# EasyEDA Pro project AQM2bv2.epro

# Schematic Schematic1
Board Name: Board1; Create Date: 2026-05-04; Page Name: P1; Project Name: AQM2; Schematic Name: Schematic1; Update Date: 2026-05-03; Company: EasyEDA.com; Page Size: A4; Version: V1.0
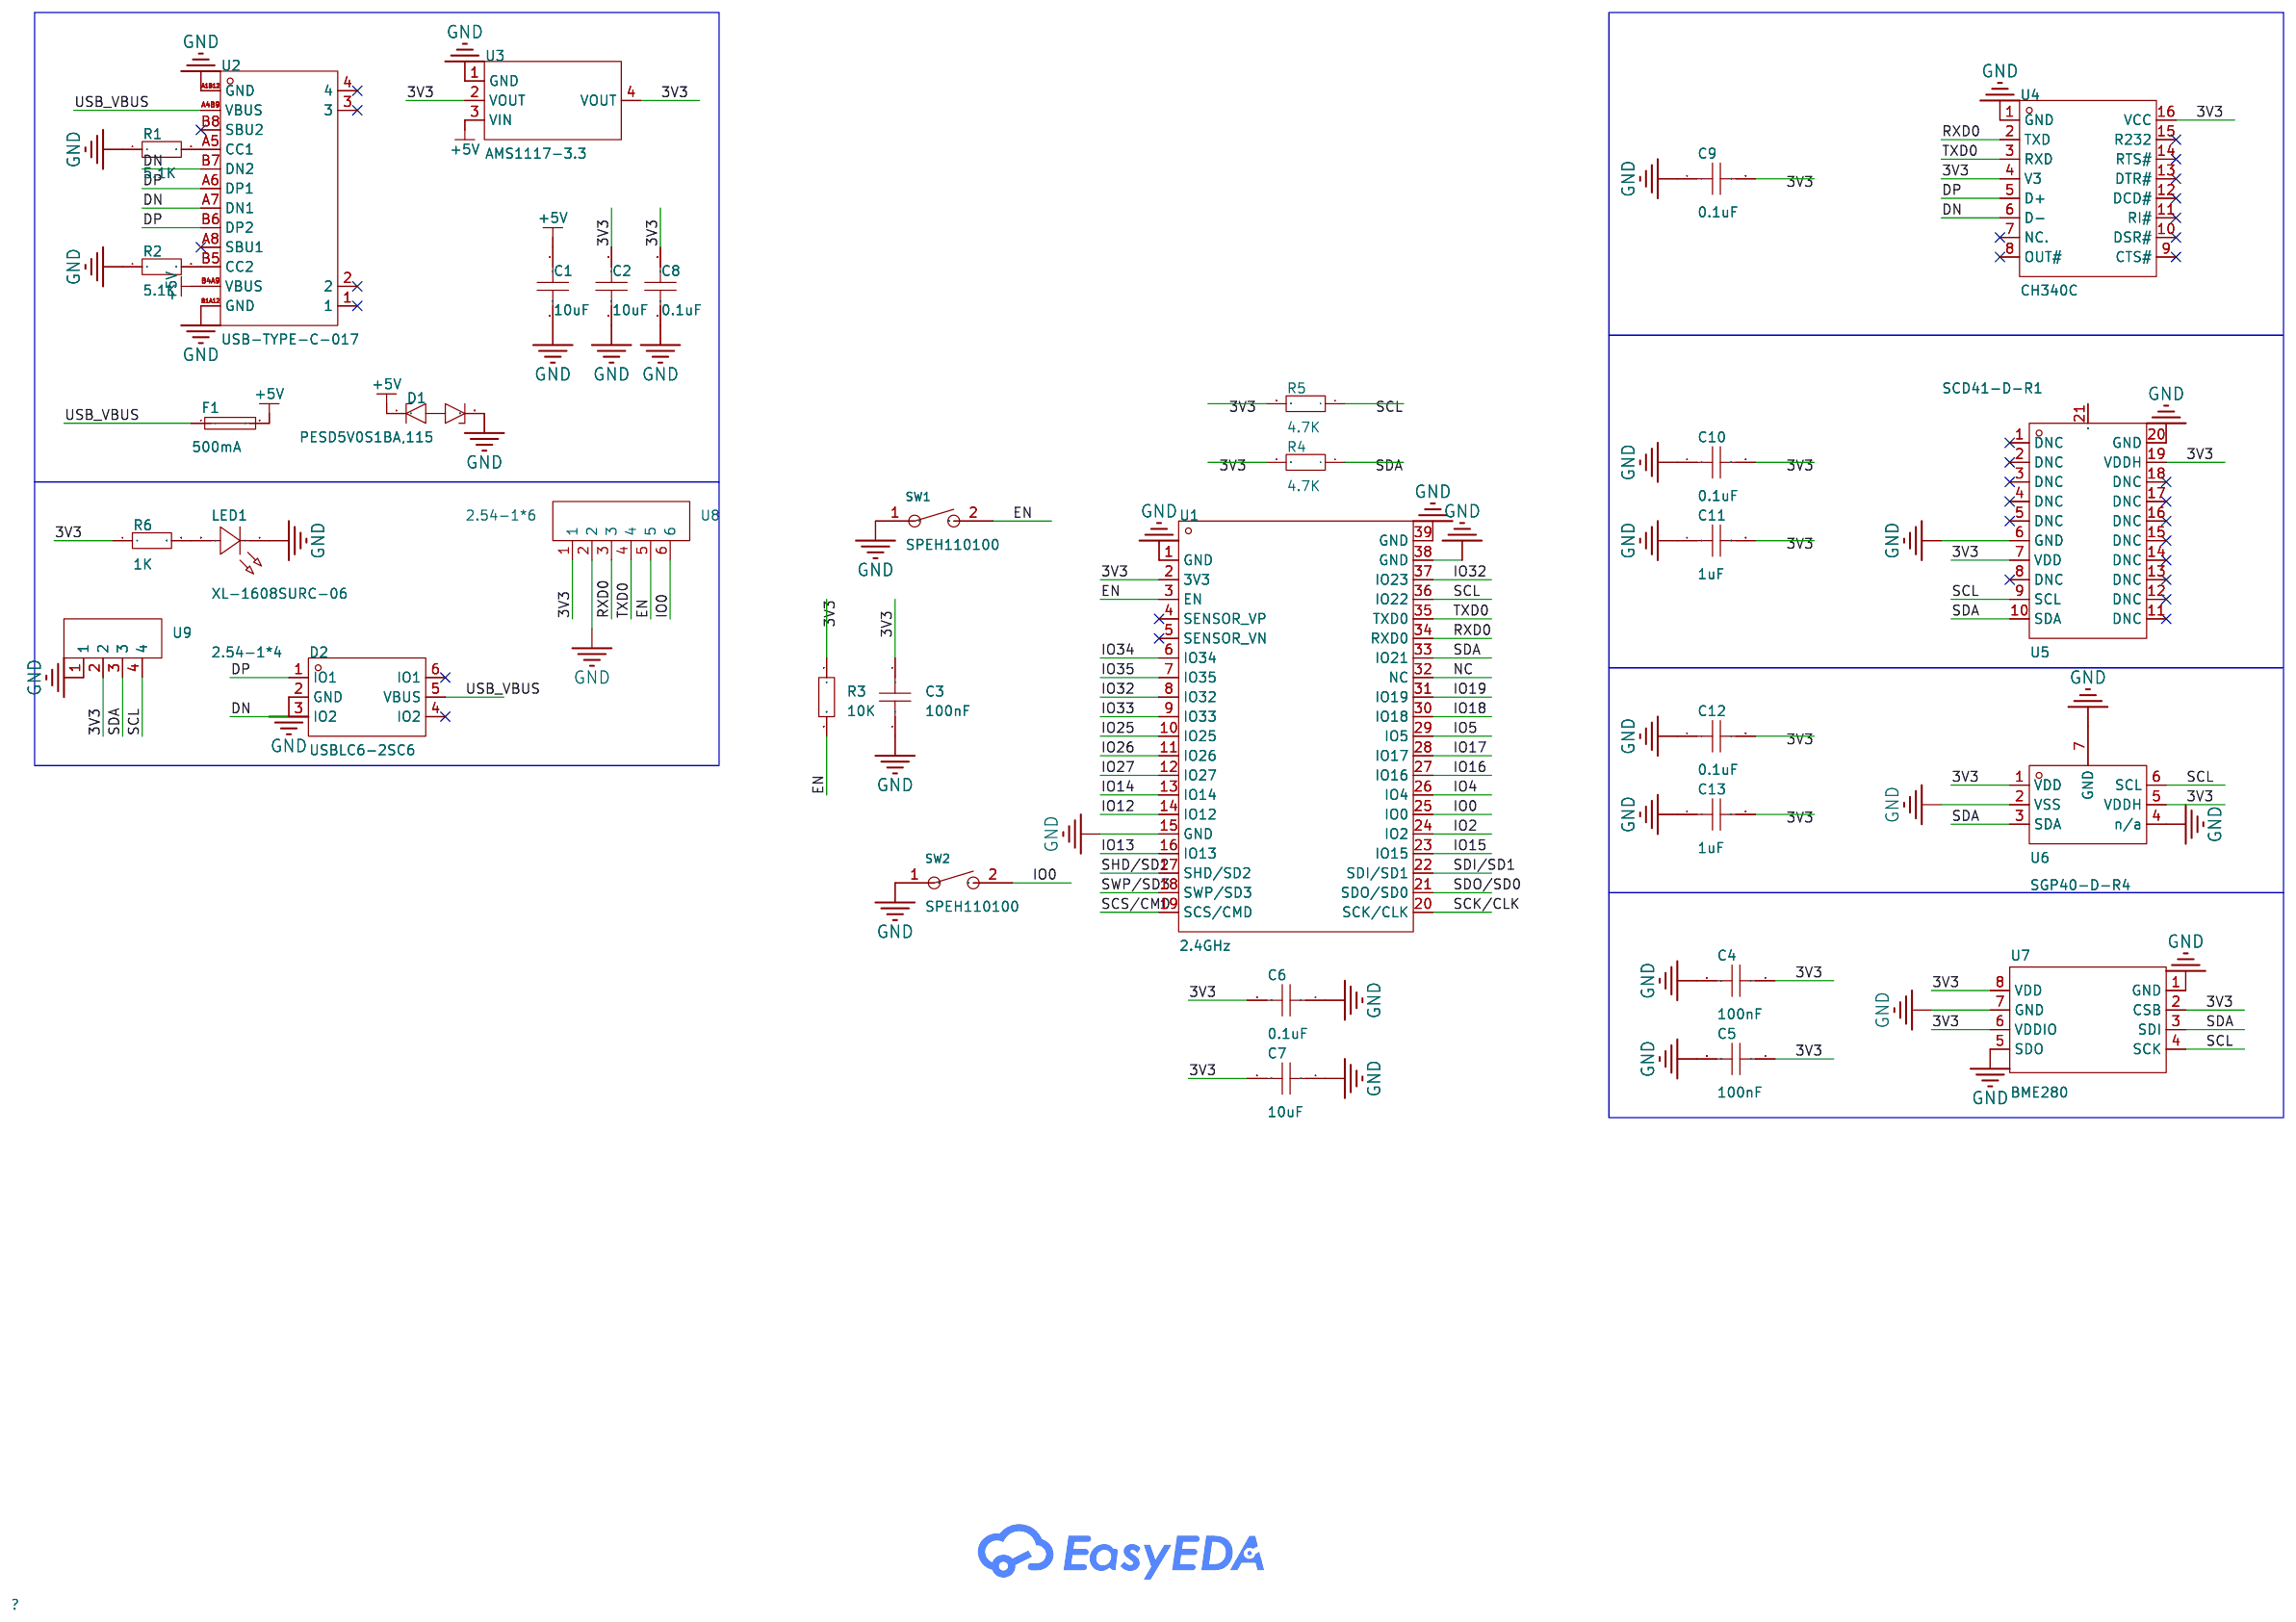
[diagram p0: schematic sheet]

## Parts
C1  10uF  [C0603]
C2  10uF  [C0603]
C3  100nF  [C0603]
C4  100nF  [C0603]
C5  100nF  [C0603]
C6  0.1uF  [C0603]
C7  10uF  [C0603]
C8  0.1uF  [C0603]
C9  0.1uF  [C0603]
C10  0.1uF  [C0603]
C11  1uF  [C0603]
C12  0.1uF  [C0603]
C13  1uF  [C0603]
D1  PESD5V0S1BA,115  [SOD-323_L1.7-W1.3-LS2.5-BI]
D2  USBLC6-2SC6  [SOT-23-6_L2.9-W1.6-P0.95-LS2.8-BL]
F1  500mA  [F1812]
LED1  XL-1608SURC-06  [LED0603-RD_RED]
R1  5.1K  [R0603]
R2  5.1K  [R0603]
R3  10K  [R0603]
R4  4.7K  [R0603]
R5  4.7K  [R0603]
R6  1K  [R0603]
SW1  SPEH110100  [SW-SMD_L6.0-W6.0-LS6.6]
SW2  SPEH110100  [SW-SMD_L6.0-W6.0-LS6.6]
U1  2.4GHz  [WIFIM-SMD_ESP32-WROOM-32-N4]
U2  USB-TYPE-C-017  [USB-TYPE-C-SMD_C9900008089]
U3  AMS1117-3.3  [SOT-223-3_L6.5-W3.4-P2.30-LS7.0-BR]
U4  CH340C  [SOP-16_L10.0-W3.9-P1.27-LS6.0-BL]
U5  SCD41-D-R1  [SENSOR-SMD_SCD41-D-R1]
U6  SGP40-D-R4  [DFN-6_L2.4-W2.4-P0.80-TL-EP]
U7  BME280  [LGA-8_BME280_BL]
U8  2.54-1*6  [HDR-TH_6P-P2.54-V-M]
U9  2.54-1*4  [HDR-TH_4P-P2.54-V-M-1]

## Library data of the parts
C1-C13 = CAP_0603: Supplier Footprint: 0603
D1 = PESD5V0S1BA,115: Polarity:Bidirectional Reverse Stand-Off Voltage (Vrwm):5V Clamping Voltage:14V Peak Pulse Current (Ipp):12A@8/20us Peak Pulse Power Dissipation (Ppp):130W@8/20us Voltage - Breakdown:9.5V Reverse Leakage Current (Ir):5nA Number of Channels:1 Operating Tem; LCSC Part Name: 双向ESD 5V截止 峰值浪涌电流：12A@8/20us; Supplier Part: C19224; Manufacturer: Nexperia(安世); Supplier Footprint: SOD-323; JLCPCB Part Class: Extended Part; Datasheet: https://item.szlcsc.com/datasheet/PESD5V0S1BA%252C115/19931.html; Supplier: LCSC; Polarity: Bidirectional; Reverse Stand-Off Voltage (Vrwm): 5V; Clamping Voltage: 14V; Peak Pulse Current (Ipp): 12A@8/20us; Peak Pulse Power Dissipation (Ppp): 130W@8/20us; Voltage - Breakdown: 9.5V; Reverse Leakage Current (Ir): 5nA; Number of Channels: 1; Operating Temperature: -55℃~+150℃; level of protection: IEC 61000-4-5；IEC 61000-4-2; Type: ESD; Junction Capacitance: 35pF
D2 = USBLC6-2SC6_C2827654: Polarity:Unidirectional Reverse Stand-Off Voltage (Vrwm):5V Clamping Voltage:12V Peak Pulse Current (Ipp):6A Peak Pulse Power Dissipation (Ppp):150W Voltage - Breakdown:6V Reverse Leakage Current (Ir):80nA Number of Channels:2 Operating Temperature:-55℃~+; LCSC Part Name: ESD，可防30kV静电; Supplier Part: C2827654; Manufacturer: TECH PUBLIC(台舟); Supplier Footprint: SOT-23-6; JLCPCB Part Class: Extended Part; Datasheet: https://item.szlcsc.com/datasheet/USBLC6-2SC6/2973336.html; Supplier: LCSC; Polarity: Unidirectional; Reverse Stand-Off Voltage (Vrwm): 5V; Clamping Voltage: 12V; Peak Pulse Current (Ipp): 6A; Peak Pulse Power Dissipation (Ppp): 150W; Voltage - Breakdown: 6V; Reverse Leakage Current (Ir): 80nA; Number of Channels: 2; Operating Temperature: -55℃~+125℃; level of protection: IEC 61000-4-2；IEC 61000-4-4；IEC 61000-4-5; Type: ESD; Junction Capacitance: 0.35pF
F1 = SMD1812P260TF/16_C438899: Voltage - Max:16V Current - Max:100A Hold Current:2.6A Trip Current:5A Power Dissipation:1.2W Resistance - Initial (Ri) (Min):15mΩ Resistance - Post Trip (R1) (Max):50mΩ Time to Trip(Max):5s Operating Temperature:-40℃~+85℃ Operating Temperature:-40℃~+85℃; LCSC Part Name: 16V 2.6A 1812自恢复; Supplier Part: C438899; Manufacturer: PTTC(聚鼎); Supplier Footprint: 1812; JLCPCB Part Class: Extended Part; Datasheet: https://item.szlcsc.com/datasheet/SMD1812P260TF%252F16/437537.html; Supplier: LCSC; Voltage - Max: 16V; Current - Max: 100A; Hold Current: 2.6A; Trip Current: 5A; Power Dissipation: 1.2W; Resistance - Initial (Ri) (Min): 15mΩ; Resistance - Post Trip (R1) (Max): 50mΩ; Time to Trip(Max): 5s; Operating Temperature: -40℃~+85℃; Length: 4.9mm; Width: 3.5mm; Height: 2mm
LED1 = XL-1608SURC-06: Lamp Holder Type:- Illumination Color:Red Voltage - Forward(Vf):2.3V Voltage - Forward(Vf):2.3V Power(Watts):50mW Forward Current:20mA Wavelength - Dominant:620nm~630nm Wavelength - Dominant:620nm~630nm Peak Wavelength:625nm Diode Configuration:Discrete D; LCSC Part Name: 0603红色贴片式发光二极管; Supplier Part: C965799; Manufacturer: XINGLIGHT(成兴光); Supplier Footprint: 0603; JLCPCB Part Class: Extended Part; Datasheet: https://item.szlcsc.com/datasheet/XL-1608SURC-06/1051408.html; Supplier: LCSC; Illumination Color: Red; Voltage - Forward(Vf): 2.3V; Power(Watts): 50mW; Forward Current: 20mA; Wavelength - Dominant: 620nm~630nm; Peak Wavelength: 625nm; Diode Configuration: Discrete Diode; Lens Color: Water Clear; Luminous Intensity: 225mcd; Viewing Angle: 120°; Mounting Style: Top-mount; Operating Temperature: -40℃~+85℃
R1-R6 = Res_0603: Supplier Footprint: 0603
SW1 SW2 = SPEH110100: Self Lock / No Lock:- Actuator Style:Square Button IP Rating:- Mounting Type:Surface Mount,Vertical Contact Current:50mA Voltage Rating:16V Actuator/Cap Color:Black With Lamp:- Termination Style:J-Lead Operating Force:1.96N Operating Temperature:-40℃~+90℃; Supplier Part: C97448; Manufacturer: ALPSALPINE(阿尔卑斯阿尔派); Supplier Footprint: SMD,6x6mm; JLCPCB Part Class: Extended Part; Datasheet: https://item.szlcsc.com/datasheet/SPEH110100/98656.html; Supplier: LCSC; Actuator Style: Square Button; Mounting Type: Surface Mount,Vertical; Contact Current: 50mA; Voltage Rating: 16V; Actuator/Cap Color: Black; Termination Style: J-Lead; Operating Force: 1.96N; Operating Temperature: -40℃~+90℃
U1 = ESP32-WROOM-32-N4: Utilized IC / Part:ESP32-DOWDQ6 Wireless Standard:Bluetooth4.2 Interface Type:I2C；GPIO；UART；DAC；SPI；PWM；SDIO；ADC Frequency:2.4GHz Output Power:20dBm Output Power:20dBm Voltage - Supply:2.7V~3.6V Voltage - Supply:2.7V~3.6V Sensitivity:-98dBm Sensitivity:-9; LCSC Part Name: 不带固件 WiFi+蓝牙4.2+双核CPU模块; Supplier Part: C82899; Manufacturer: ESPRESSIF(乐鑫); Supplier Footprint: SMD,25.5x18mm; JLCPCB Part Class: Extended Part; Datasheet: https://item.szlcsc.com/datasheet/ESP32-WROOM-32-N4/84060.html; Supplier: LCSC; Utilized IC / Part: ESP32-DOWDQ6; Wireless Standard: Bluetooth4.2; Interface Type: I2C；GPIO；UART；DAC；SPI；PWM；SDIO；ADC; Output Power: 20dBm; Voltage - Supply: 2.7V~3.6V; Sensitivity: -98dBm; Operating Temperature: -40℃~+85℃
U2 = USB-TYPE-C-017: Connector Type:Type-C Protocol Standard:- Gender:Female Mounting Type:Surface Mount, Right Angle Number of Contacts:16P Number of Ports:1 Current Rating-Power:3A Voltage Rating:5V Connect-Disconnect Life:10,000 cycles Length:7.35mm Operating Temperature:-; LCSC Part Name: Type-C 母 卧贴; Supplier Part: C2927037; Manufacturer: DEALON(德艺隆); Supplier Footprint: SMD; JLCPCB Part Class: Extended Part; Datasheet: https://item.szlcsc.com/datasheet/USB-TYPE-C-017/3252506.html; Supplier: LCSC; Connector Type: Type-C; Gender: Female; Mounting Type: Surface Mount, Right Angle; Number of Contacts: 16P; Number of Ports: 1; Current Rating-Power: 3A; Voltage Rating: 5V; Connect-Disconnect Life: 10,000 cycles; Length: 7.35mm; Operating Temperature: -25℃~+85℃
U3 = AMS1117-3.3_C6186: Output Type:Fixed Voltage - Supply:15V Output Voltage:3.3V Output Voltage:3.3V Output Current:1A Power Supply Rejection Ratio (PSRR):72dB@(120Hz) Voltage Dropout:1.1V@(800mA) standby current:5mA Noise:0.003%Vout Features:Over Current Protection；Thermal Sh; LCSC Part Name: 3.3V 1A 15V; Supplier Part: C6186; Manufacturer: AMS; Supplier Footprint: SOT-223; JLCPCB Part Class: Basic Part; Datasheet: https://item.szlcsc.com/datasheet/AMS1117-3.3/6652.html; Supplier: LCSC; Output Type: Fixed; Voltage - Supply: 15V; Output Voltage: 3.3V; Output Current: 1A; Power Supply Rejection Ratio (PSRR): 72dB@(120Hz); Voltage Dropout: 1.1V@(800mA); standby current: 5mA; Noise: 0.003%Vout; Features: Over Current Protection；Thermal Shutdown; Operating Temperature: -40℃~+125℃; Output Configuration: Positive; Number of Outputs: 1
U4 = CH340C: Applications Function:Transceiver USB Protocol:USB 2.0 Voltage - Supply:3.3V；5V Voltage - Supply:3.3V；5V Data Rate:2Mbps Operating Temperature:-20℃~+70℃ Operating Temperature:-20℃~+70℃ Current - Supply:7mA Supply Current (Iq):50uA; LCSC Part Name: USB转串口芯片; Supplier Part: C84681; Manufacturer: WCH(南京沁恒); Supplier Footprint: SOP-16; JLCPCB Part Class: Extended Part; Datasheet: https://item.szlcsc.com/datasheet/CH340C/85852.html; Supplier: LCSC; Applications Function: Transceiver; USB Protocol: USB 2.0; Voltage - Supply: 3.3V；5V; Data Rate: 2Mbps; Operating Temperature: -20℃~+70℃; Current - Supply: 7mA; Supply Current (Iq): 50uA
U5 = SCD41-D-R1: Type:Air quality Measurement Range:400ppm~5000ppm Measurement Range:400ppm~5000ppm Voltage - Supply:2.4V~5.5V Voltage - Supply:2.4V~5.5V Interface:I2C Tolerance:±5% Tolerance:±5% Operating Temperature:-10℃~+60℃ Operating Temperature:-10℃~+60℃ Length:10.1m; LCSC Part Name: 3.000.960 3.000.960 扩展的测量范围二氧化碳传感器 测量精度，支持单次测量（Single‑Shot）模式; Supplier Part: C3659362; Manufacturer: Sensirion(瑞士盛思锐); Supplier Footprint: LGA-20(10.1x10.1); JLCPCB Part Class: Extended Part; Datasheet: https://item.szlcsc.com/datasheet/SCD41-D-R1/4227159.html; Supplier: LCSC; Type: Air quality; Measurement Range: 400ppm~5000ppm; Voltage - Supply: 2.4V~5.5V; Interface: I2C; Tolerance: ±5%; Operating Temperature: -10℃~+60℃; Length: 10.1mm; Width: 10.1mm; Height: 6.5mm; Current - Supply: 0.36mA
U6 = SGP40-D-R4: Type:- Measurement Range:0ppm~1000ppm Measurement Range:0ppm~1000ppm Voltage - Supply:1.7V~3.6V Voltage - Supply:1.7V~3.6V Interface:I2C Operating Temperature:-10℃~+50℃ Operating Temperature:-10℃~+50℃ Length:2.44mm；2.44mm Height:0.85mm; LCSC Part Name: 3.000.384 3.000.384 适用于室内空气质量应用的 VOC 传感器; Supplier Part: C2874215; Manufacturer: Sensirion(瑞士盛思锐); Supplier Footprint: DFN-6-EP(2.4x2.4); JLCPCB Part Class: Extended Part; Datasheet: https://item.szlcsc.com/datasheet/SGP40-D-R4/3079263.html; Supplier: LCSC; Measurement Range: 0ppm~1000ppm; Voltage - Supply: 1.7V~3.6V; Interface: I2C; Operating Temperature: -10℃~+50℃; Length: 2.44mm；2.44mm; Height: 0.85mm
U7 = BME280: Temperature Range:-40℃~+85℃ Temperature Range:-40℃~+85℃ Humidity:0%RH~100%RH Humidity:0%RH~100%RH Interface:I2C；SPI Voltage - Supply:1.71V~3.6V Voltage - Supply:1.71V~3.6V Current - Supply:1.8uA Humidity Tolerance:±3%RH Humidity Tolerance:±3%RH Temperatur; LCSC Part Name: 湿度：0%RH~100%RH; Supplier Part: C92489; Manufacturer: Bosch(博世); Supplier Footprint: LGA-8(2.5x2.5); JLCPCB Part Class: Extended Part; Datasheet: https://item.szlcsc.com/datasheet/BME280/93682.html; Supplier: LCSC; Temperature Range: -40℃~+85℃; Humidity: 0%RH~100%RH; Interface: I2C；SPI; Voltage - Supply: 1.71V~3.6V; Current - Supply: 1.8uA; Humidity Tolerance: ±3%RH; Temperature Tolerance: ±0.5℃; Resolution: 16bit
U8 = 2.54-1*6: Pin Structure:1x6P Pitch:2.54mm Circluar Pins/Square Pins:Pin Header Mounting Type:Through Hole Number of Rows:1 Number of Pins:6P Current Rating:2.5A Length of Mating Pin:6mm Insulation Height:2.54mm Length of End Connection Pin:3mm Contact Material:Bras; LCSC Part Name: 1x6P 间距:2.54mm 方针 直插; Supplier Part: C5156615; Manufacturer: ZHOURI(洲日); Supplier Footprint: 插件,P=2.54mm; JLCPCB Part Class: Extended Part; Datasheet: https://item.szlcsc.com/datasheet/2.54-1*6/5790715.html; Supplier: LCSC; Pin Structure: 1x6P; Pitch: 2.54mm; Circluar Pins/Square Pins: Pin Header; Mounting Type: Through Hole; Number of Rows: 1; Number of Pins: 6P; Current Rating: 2.5A; Length of Mating Pin: 6mm; Insulation Height: 2.54mm; Length of End Connection Pin: 3mm; Contact Material: Brass; Contact Plating: Gold; Operating Temperature: -40℃~+105℃
U9 = 2.54-1*4: Pin Structure:1x4P Pitch:2.54mm Circluar Pins/Square Pins:Pin Header Mounting Type:Through Hole Number of Rows:1 Number of Pins:4P Current Rating:2.5A Length of Mating Pin:6mm Insulation Height:2.54mm Length of End Connection Pin:3mm Contact Material:Bras; LCSC Part Name: 1x4P 间距:2.54mm 方针 直插; Supplier Part: C5116483; Manufacturer: ZHOURI(洲日); Supplier Footprint: 插件,P=2.54mm; JLCPCB Part Class: Extended Part; Datasheet: https://item.szlcsc.com/datasheet/2.54-1*4/5692726.html; Supplier: LCSC; Pin Structure: 1x4P; Pitch: 2.54mm; Circluar Pins/Square Pins: Pin Header; Mounting Type: Through Hole; Number of Rows: 1; Number of Pins: 4P; Current Rating: 2.5A; Length of Mating Pin: 6mm; Insulation Height: 2.54mm; Length of End Connection Pin: 3mm; Contact Material: Brass; Contact Plating: Gold; Operating Temperature: -40℃~+105℃

## Nets
3V3: C2.1 C3.1 C4.1 C5.1 C6.2 C7.2 C8.1 C9.2 C10.2 C11.2 C12.2 C13.2 R3.1 R4.2 R5.2 R6.1 U1.2(3V3) U3.2(VOUT) U3.4(VOUT) U4.4(V3) U4.16(VCC) U5.7(VDD) U5.19(VDDH) U6.1(VDD) U6.5(VDDH) U7.2(CSB) U7.6(VDDIO) U7.8(VDD) U8.1 U9.2
+5V: C1.1 D1.1 F1.2 U2.B4A9(VBUS) U3.3(VIN)
GND: C1.2 C2.2 C3.2 C4.2 C5.2 C6.1 C7.1 C8.2 C9.1 C10.1 C11.1 C12.1 C13.1 D1.2 D2.2(GND) LED1.1(K) R1.1 R2.1 SW1.1 SW2.1 U1.1(GND) U1.15(GND) U1.38(GND) U1.39(GND) U2.A1B12(GND) U2.B1A12(GND) U3.1(GND) U4.1(GND) U5.6(GND) U5.20(GND) U6.2(VSS) U6.4(n/a) U6.7(GND) U7.1(GND) U7.5(SDO) U7.7(GND) U8.2 U9.1
DN: D2.3(IO2) U2.A7(DN1) U2.B7(DN2) U4.6(D-)
DP: D2.1(IO1) U2.A6(DP1) U2.B6(DP2) U4.5(D+)
EN: R3.2 SW1.2 U1.3(EN) U8.5
IO0: SW2.2 U1.25(IO0) U8.6
IO2: U1.24(IO2)
IO4: U1.26(IO4)
IO5: U1.29(IO5)
IO12: U1.14(IO12)
IO13: U1.16(IO13)
IO14: U1.13(IO14)
IO15: U1.23(IO15)
IO16: U1.27(IO16)
IO17: U1.28(IO17)
IO18: U1.30(IO18)
IO19: U1.31(IO19)
IO25: U1.10(IO25)
IO26: U1.11(IO26)
IO27: U1.12(IO27)
IO32: U1.8(IO32) U1.37(IO23)
IO33: U1.9(IO33)
IO34: U1.6(IO34)
IO35: U1.7(IO35)
NC: U1.32(NC)
RXD0: U1.34(RXD0) U4.2(TXD) U8.3
SCK/CLK: U1.20(SCK/CLK)
SCL: R5.1 U1.36(IO22) U5.9(SCL) U6.6(SCL) U7.4(SCK) U9.4
SCS/CMD: U1.19(SCS/CMD)
SDA: R4.1 U1.33(IO21) U5.10(SDA) U6.3(SDA) U7.3(SDI) U9.3
SDI/SD1: U1.22(SDI/SD1)
SDO/SD0: U1.21(SDO/SD0)
SHD/SD2: U1.17(SHD/SD2)
SWP/SD3: U1.18(SWP/SD3)
TXD0: U1.35(TXD0) U4.3(RXD) U8.4
USB_VBUS: D2.5(VBUS) F1.1 U2.A4B9(VBUS)
$1N863: R1.2 U2.A5(CC1)
$1N889: R2.2 U2.B5(CC2)
$1N3374: LED1.2(A) R6.2

Not connected (* = marked no-connect by the designer): D2 4(IO2)* 6(IO1)*; U1 4(SENSOR_VP)* 5(SENSOR_VN)*; U2 1* 2* 3* 4* A8(SBU1)* B8(SBU2)*; U4 7(NC.)* 8(OUT#)* 9(CTS#)* 10(DSR#)* 11(RI#)* 12(DCD#)* 13(DTR#)* 14(RTS#)* 15(R232)*; U5 1(DNC)* 2(DNC)* 3(DNC)* 4(DNC)* 5(DNC)* 8(DNC)* 11(DNC)* 12(DNC)* 13(DNC)* 14(DNC)* 15(DNC)* 16(DNC)* 17(DNC)* 18(DNC)* 21(GND)

# Schematic Schematic2
Board Name: Board2; Create Date: 2026-05-22; Page Name: P1; Project Name: AQM2; Schematic Name: Schematic2; Update Date: 2026-05-22; Company: EasyEDA.com; Page Size: A4; Version: V1.0
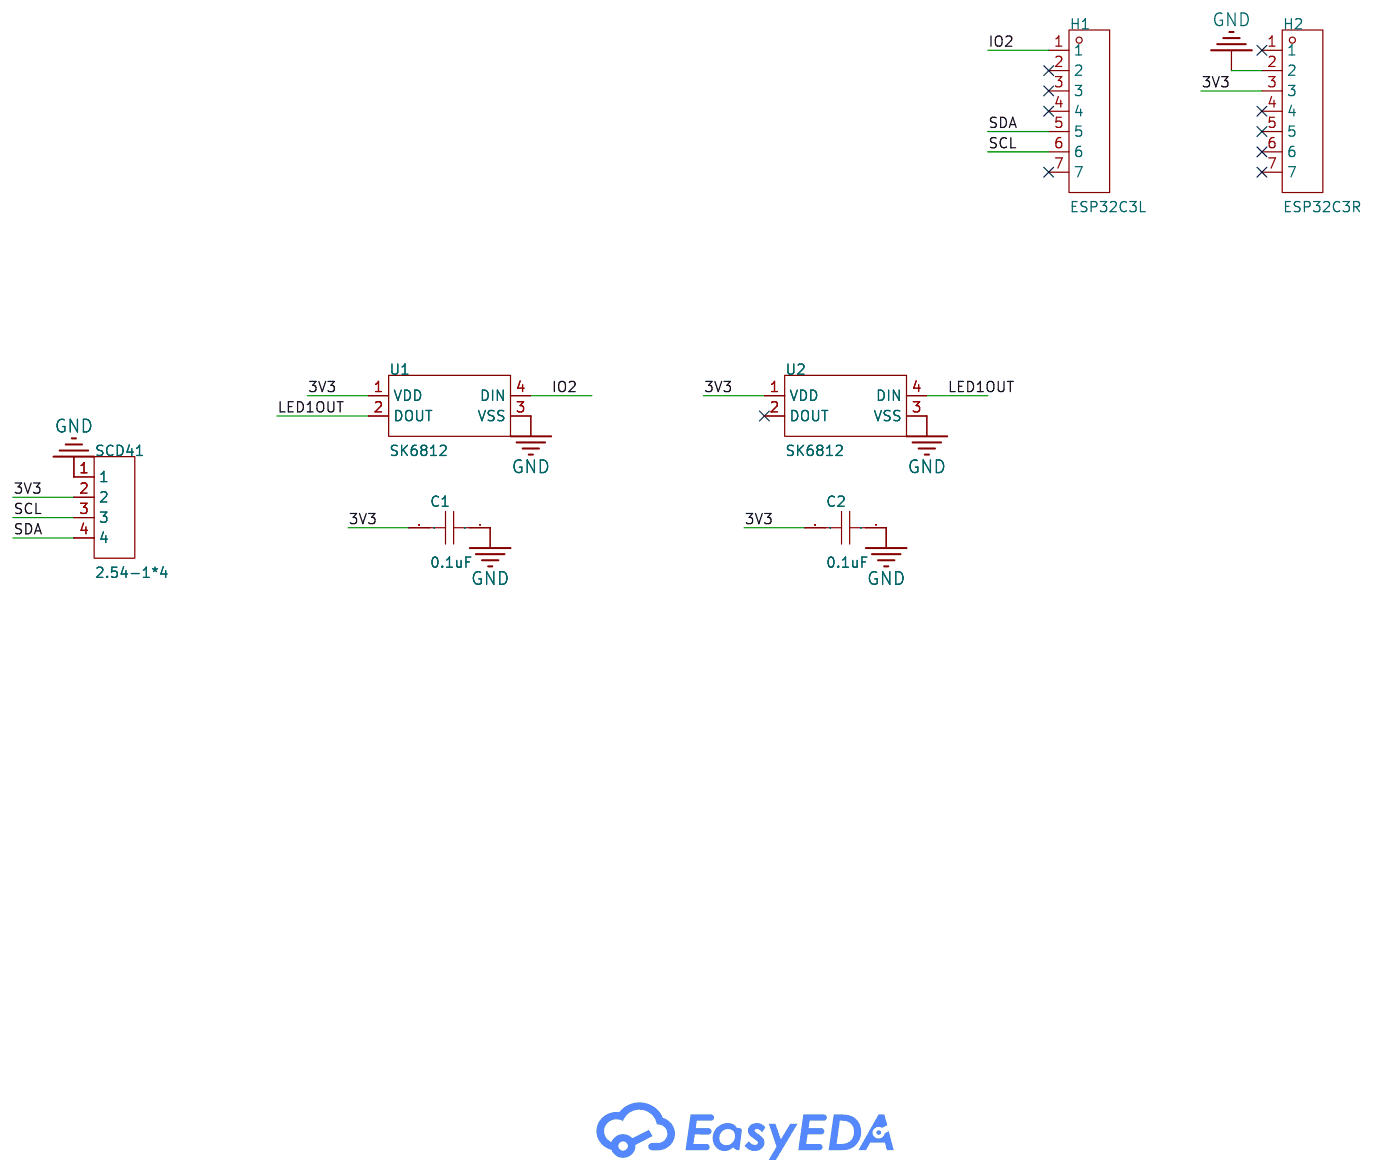
[diagram p1: schematic sheet]

## Parts
C1  0.1uF  [C0603]
C2  0.1uF  [C0603]
H1  ESP32C3L  [HDR-TH_7P-P2.54-V-M]
H2  ESP32C3R  [HDR-TH_7P-P2.54-V-M]
SCD41  2.54-1*4  [HDR-TH_4P-P2.54-V-M-1]
U1  SK6812  [LED-SMD_4P-L5.0-W5.0-LS5.4-TL-1]
U2  SK6812  [LED-SMD_4P-L5.0-W5.0-LS5.4-TL-1]

## Library data of the parts
C1 C2 = CAP_0603: Supplier Footprint: 0603
H1 H2 = HX PZ2.54-1x7P ZZ: Pin Structure:1x7P Pitch:2.54mm Row Spacing:- Circluar Pins/Square Pins:Pin Header Mounting Type:Through Hole Number of Rows:1 Number of Pins:7P Current Rating:3A Voltage Rating (Max):1kV Length of Mating Pin:6mm Insulation Height:2.5mm Length of End Conn; LCSC Part Name: 1x7P 间距:2.54mm 方针 直插; Supplier Part: C32713273; Manufacturer: hanxia(韩下); Supplier Footprint: 插件,P=2.54mm; JLCPCB Part Class: Extended Part; Datasheet: https://item.szlcsc.com/datasheet/HX%2520PZ2.54-1x7P%2520ZZ/34444553.html; Supplier: LCSC; Pin Structure: 1x7P; Pitch: 2.54mm; Circluar Pins/Square Pins: Pin Header; Mounting Type: Through Hole; Number of Rows: 1; Number of Pins: 7P; Current Rating: 3A; Voltage Rating (Max): 1kV; Length of Mating Pin: 6mm; Insulation Height: 2.5mm; Length of End Connection Pin: 3mm; Contact Material: Brass; Contact Plating: Gold; Operating Temperature: -40℃~+105℃; Color: Black
SCD41 = 2.54-1*4: Pin Structure:1x4P Pitch:2.54mm Circluar Pins/Square Pins:Pin Header Mounting Type:Through Hole Number of Rows:1 Number of Pins:4P Current Rating:2.5A Length of Mating Pin:6mm Insulation Height:2.54mm Length of End Connection Pin:3mm Contact Material:Bras; LCSC Part Name: 1x4P 间距:2.54mm 方针 直插; Supplier Part: C5116483; Manufacturer: ZHOURI(洲日); Supplier Footprint: 插件,P=2.54mm; JLCPCB Part Class: Extended Part; Datasheet: https://item.szlcsc.com/datasheet/2.54-1*4/5692726.html; Supplier: LCSC; Pin Structure: 1x4P; Pitch: 2.54mm; Circluar Pins/Square Pins: Pin Header; Mounting Type: Through Hole; Number of Rows: 1; Number of Pins: 4P; Current Rating: 2.5A; Length of Mating Pin: 6mm; Insulation Height: 2.54mm; Length of End Connection Pin: 3mm; Contact Material: Brass; Contact Plating: Gold; Operating Temperature: -40℃~+105℃
U1 U2 = SK6812_C5378720: Wavelength:R:620nm~625nm；B:460nm~470nm；G:520nm~530nm Luminous Intensity:B:160mcd~320mcd；R:280mcd~515mcd；G:815mcd~1275mcd Fixed-Frequency Pwm Mode:1kHz Data Transmission Rate:800Kbit/s Voltage - Supply:3.7V~5.5V Voltage - Supply:3.7V~5.5V Quiescent Current; LCSC Part Name: 5.4x5.0x1.6毫米0.2W智能外控表面贴装SMD型LED; Supplier Part: C5378720; Manufacturer: 欧思科光电; Supplier Footprint: SMD-4P,5.4x5mm; JLCPCB Part Class: Extended Part; Datasheet: https://item.szlcsc.com/datasheet/SK6812/6242291.html; Supplier: LCSC; Wavelength: R:620nm~625nm；B:460nm~470nm；G:520nm~530nm; Luminous Intensity: B:160mcd~320mcd；R:280mcd~515mcd；G:815mcd~1275mcd; Fixed-Frequency Pwm Mode: 1kHz; Data Transmission Rate: 800Kbit/s; Voltage - Supply: 3.7V~5.5V; Quiescent Current: 0.6mA; Lens Color: Semi-transparent lens; ESD Withstand Voltage: 2000V; Operating Temperature: -40℃~+85℃; Viewing Angle: 120°; Height: 1.6mm

## Nets
3V3: C1.2 C2.2 H2.3 SCD41.2 U1.1(VDD) U2.1(VDD)
GND: C1.1 C2.1 H2.2 SCD41.1 U1.3(VSS) U2.3(VSS)
IO2: H1.1 U1.4(DIN)
LED1OUT: U1.2(DOUT) U2.4(DIN)
SCL: H1.6 SCD41.3
SDA: H1.5 SCD41.4

Not connected (* = marked no-connect by the designer): H1 2* 3* 4* 7*; H2 1* 4* 5* 6* 7*; U2 2(DOUT)*

# Board PCB1
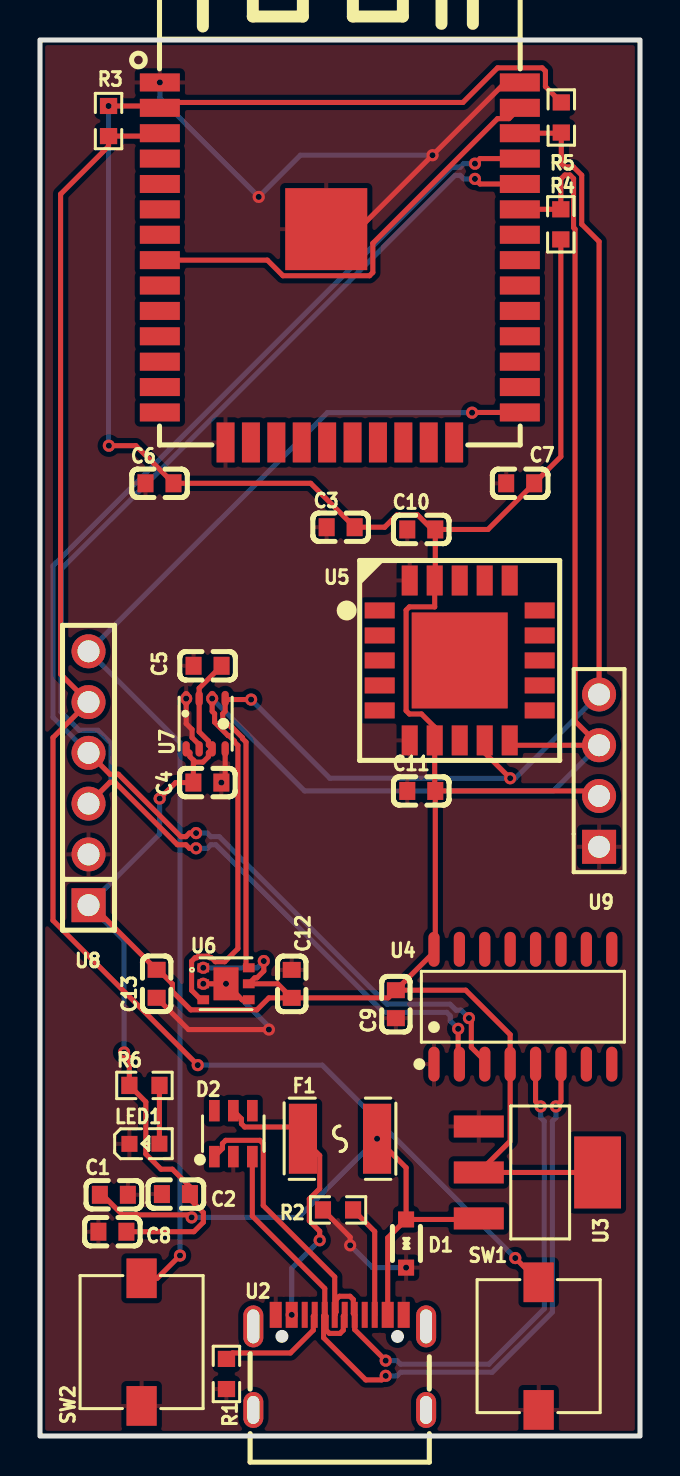
[diagram p2: board, top side]
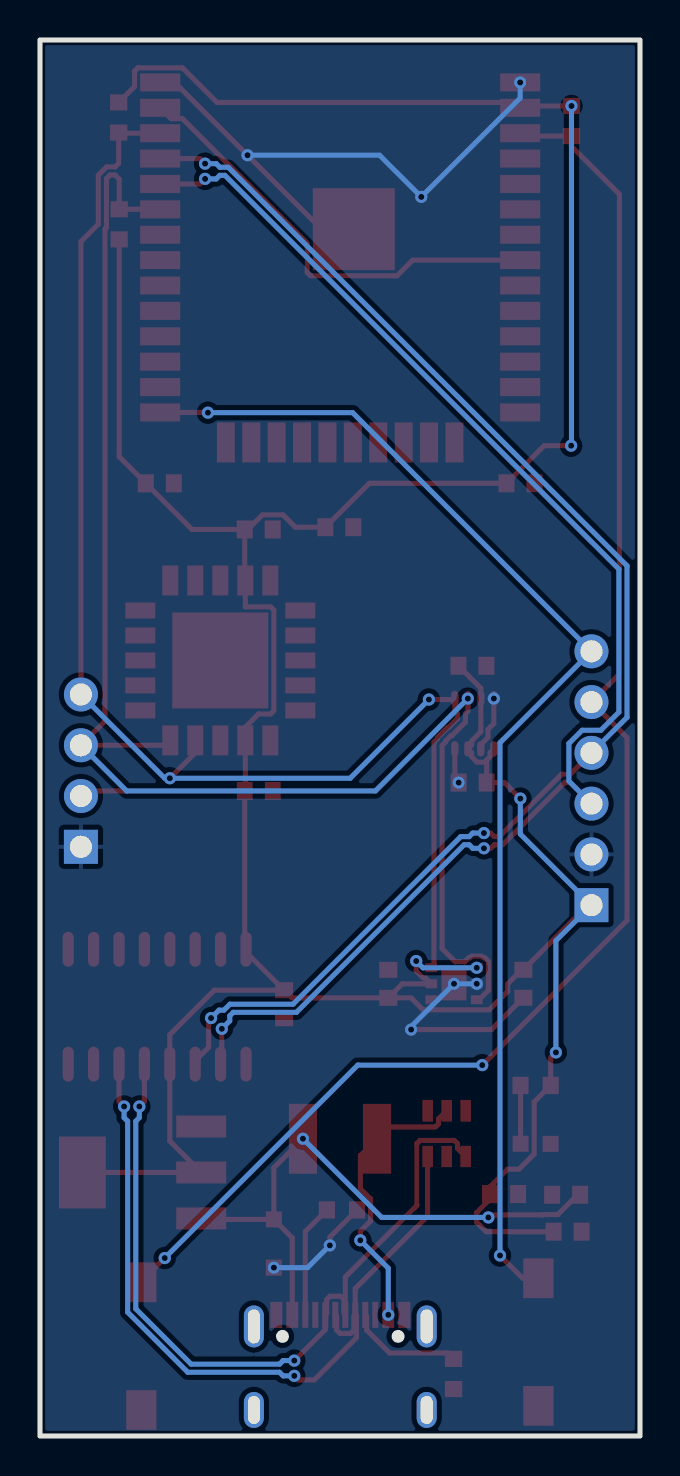
[diagram p3: board, bottom side, seen from below]

Outline 30 x 69.84 mm; copper layers: Top Layer, Bottom Layer. Coordinates in mm from the lower left corner of the outline.
Outline path: rectangle 0,69.84 30,0
Stack: Top Layer 0.035mm / Dielectric1 1.51mm FR4 er 4.5 / Bottom Layer 0.035mm

## Design rules (mm)
net DP: DP3
net DN: DP3
net SDA: DP2
net SCL: DP2
net RXD0: DP1
net TXD0: DP1
template: JLCPCB Capability(Two Layers Board)
spacing copperThickness1oz (default): track to track 0.102, other pairs 0.152 to 0.3
spacing copperThickness2oz: track to track 0.203, other pairs 0.152 to 0.3
track width copperThickness1oz (default): min 0.127, default 0.254, max 2.54
track width copperThickness2oz: min 0.203, default 0.254, max 2.54
differential pair differentialPair (default): width min 0.127, default 0.254, max 2.54; gap min 0.152, default 0.152
via viaSize (default): diameter min 0.5, default 0.61, max 10; hole min 0.3, default 0.305, max 6.3

## Placement (name value [footprint] x y rotation side)
C1  10uF  [C0603]  3.69 12.07 0 top
C2  10uF  [C0603]  6.79 12.1 180 top
C3  100nF  [C0603]  15.03 45.46 180 top
C4  100nF  [C0603]  8.37 32.69 0 top
C5  100nF  [C0603]  8.38 38.53 180 top
C6  0.1uF  [C0603]  5.97 47.66 0 top
C7  10uF  [C0603]  24.01 47.66 0 top
C8  0.1uF  [C0603]  3.62 10.22 180 top
C9  0.1uF  [C0603]  17.79 21.6 90 top
C10  0.1uF  [C0603]  19.06 45.35 0 top
C11  1uF  [C0603]  19.06 32.27 0 top
C12  0.1uF  [C0603]  12.59 22.62 270 top
C13  1uF  [C0603]  5.83 22.62 90 top
D1  PESD5V0S1BA,115  [SOD-323_L1.7-W1.3-LS2.5-BI]  18.31 9.63 270 top
D2  USBLC6-2SC6  [SOT-23-6_L2.9-W1.6-P0.95-LS2.8-BL]  9.67 15.13 0 top
F1  500mA  [F1812]  15 14.87 0 top
LED1  XL-1608SURC-06  [LED0603-RD_RED]  5.22 14.62 0 top
R1  5.1K  [R0603]  9.32 3.1 90 top
R2  5.1K  [R0603]  14.9 11.31 0 top
R3  10K  [R0603]  3.43 65.78 270 top
R4  4.7K  [R0603]  26.04 60.62 270 top
R5  4.7K  [R0603]  26.07 65.96 90 top
R6  1K  [R0603]  5.22 17.54 0 top
SW1  SPEH110100  [SW-SMD_L6.0-W6.0-LS6.6]  24.93 4.5 90 top
SW2  SPEH110100  [SW-SMD_L6.0-W6.0-LS6.6]  5.08 4.7 90 top
U1  2.4GHz  [WIFIM-SMD_ESP32-WROOM-32-N4]  14.99 58.71 0 top
U2  USB-TYPE-C-017  [USB-TYPE-C-SMD_C9900008089]  14.99 3.68 0 top
U3  AMS1117-3.3  [SOT-223-3_L6.5-W3.4-P2.30-LS7.0-BR]  24.91 13.18 180 top
U4  CH340C  [SOP-16_L10.0-W3.9-P1.27-LS6.0-BL]  24.14 21.48 0 top
U5  SCD41-D-R1  [SENSOR-SMD_SCD41-D-R1]  20.98 38.8 0 top
U6  SGP40-D-R4  [DFN-6_L2.4-W2.4-P0.80-TL-EP]  9.3 22.62 0 top
U7  BME280  [LGA-8_BME280_BL]  8.28 35.63 90 top
U8  2.54-1*6  [HDR-TH_6P-P2.54-V-M]  2.43 32.91 90 top
U9  2.54-1*4  [HDR-TH_4P-P2.54-V-M-1]  27.95 33.29 90 top

## Footprints (pads in the part's own frame, mm; a bottom-side part is the same pattern mirrored in y, then rotated)
C0603
  rect 0.8x0.9 smd: 1(-0.7,0) 2(0.7,0)
DFN-6_L2.4-W2.4-P0.80-TL-EP
  rect 0.585x0.448 smd: 1(-1.137,0.8) 2(-1.137,0) 3(-1.137,-0.8) 4(1.137,-0.8) 5(1.137,0) 6(1.137,0.8)
  rect 1.25x1.65 smd: 7(0,0)
F1812
  rect 1.407x3.499 smd: 1(-1.853,0) 2(1.853,0)
HDR-TH_4P-P2.54-V-M-1
  rect 1.7x1.7 hole 1.1: 1(-3.81,0)
  round 1.7 hole 1.1: 2(-1.27,0) 3(1.27,0) 4(3.81,0)
HDR-TH_6P-P2.54-V-M
  rect 1.7x1.7 hole 1.1: 1(-6.35,0)
  round 1.7 hole 1.1: 2(-3.81,0) 3(-1.27,0) 4(1.27,0) 5(3.81,0) 6(6.35,0)
LED0603-RD_RED
  rect 0.8x0.8 smd: 1(-0.749,-0.004) 2(0.749,0.004)
LGA-8_BME280_BL
  oval 0.767x0.364 smd: 1(1.258,0.975) 2(1.258,0.325) 3(1.258,-0.325) 4(1.258,-0.975) 5(-1.258,-0.975) 6(-1.258,-0.325) 7(-1.258,0.325) 8(-1.258,0.975)
R0603
  rect 0.806x0.864 smd: 1(-0.753,0) 2(0.753,0)
SENSOR-SMD_SCD41-D-R1
  rect 1.5x0.8 smd: 1(-4,2.5) 2(-4,1.25) 3(-4,0.001) 4(-4,-1.25) 5(-4,-2.5) 11(4,-2.5) 12(4,-1.25) 13(4,0.001) 14(4,1.25) 15(4,2.5)
  rect 0.8x1.5 smd: 6(-2.5,-4) 7(-1.25,-4) 8(0,-4) 9(1.25,-4) 10(2.5,-4) 16(2.5,4) 17(1.25,4) 18(0,4) 19(-1.25,4) 20(-2.5,4)
  rect 4.8x4.8 smd: 21(0,0)
SOD-323_L1.7-W1.3-LS2.5-BI
  rect 0.8x0.8 smd: 1(-1.205,0) 2(1.205,0)
SOP-16_L10.0-W3.9-P1.27-LS6.0-BL
  oval 0.56x1.745 smd: 1(-4.445,-2.873) 2(-3.175,-2.873) 3(-1.905,-2.873) 4(-0.635,-2.873) 5(0.635,-2.873) 6(1.905,-2.873) 7(3.175,-2.873) 8(4.445,-2.873) 9(4.445,2.873) 10(3.175,2.873) 11(1.905,2.873) 12(0.635,2.873) 13(-0.635,2.873) 14(-1.905,2.873) 15(-3.175,2.873) 16(-4.445,2.873)
SOT-23-6_L2.9-W1.6-P0.95-LS2.8-BL
  rect 0.532x1.072 smd: 1(-0.95,-1.149) 2(0,-1.149) 3(0.95,-1.149) 4(0.95,1.149) 5(0,1.149) 6(-0.95,1.149)
SOT-223-3_L6.5-W3.4-P2.30-LS7.0-BR
  rect 2.5x1.1 smd: 1(2.97,-2.3) 2(2.97,0) 3(2.97,2.3)
  rect 2.34x3.6 smd: 4(-2.97,0)
SW-SMD_L6.0-W6.0-LS6.6
  rect 1.985x1.512 smd: 1(-3.192,0) 2(3.192,0)
USB-TYPE-C-SMD_C9900008089
  oval 1x2.1 hole 0.6x1.7: 1(-4.32,1.801) 2(4.32,1.801)
  oval 1x1.8 hole 0.6x1.4: 3(-4.32,-2.379) 4(4.32,-2.379)
  rect 0.6x1.3 smd: A1B12(-3.2,2.379) A4B9(-2.4,2.379) B1A12(3.2,2.379) B4A9(2.4,2.379)
  rect 0.3x1.3 smd: A5(-1.25,2.379) A6(-0.25,2.379) A7(0.25,2.379) A8(1.25,2.379) B5(1.75,2.379) B6(0.75,2.379) B7(-0.75,2.379) B8(-1.75,2.379)
WIFIM-SMD_ESP32-WROOM-32-N4
  rect 2x0.9 smd: 1(-9,9.005) 2(-9,7.735) 3(-9,6.465) 4(-9,5.195) 5(-9,3.925) 6(-9,2.655) 7(-9,1.385) 8(-9,0.115) 9(-9,-1.155) 10(-9,-2.425) 11(-9,-3.695) 12(-9,-4.965) 13(-9,-6.235) 14(-9,-7.505) 25(9,-7.505) 26(9,-6.235) 27(9,-4.965) 28(9,-3.695) 29(9,-2.425) 30(9,-1.155) 31(9,0.115) 32(9,1.385) 33(9,2.655) 34(9,3.925) 35(9,5.195) 36(9,6.465) 37(9,7.735) 38(9,9.005)
  rect 0.9x2 smd: 15(-5.715,-9.005) 16(-4.445,-9.005) 17(-3.175,-9.005) 18(-1.905,-9.005) 19(-0.635,-9.005) 20(0.635,-9.005) 21(1.905,-9.005) 22(3.175,-9.005) 23(4.445,-9.005) 24(5.715,-9.005)
  rect 4.1x4.1 smd: 39(-0.68,1.665)

## Nets
As in the schematic.

Pads without a net: D2 4 6; U1 4 5; U2 1 2 3 4 A8 B8; U4 7 8 9 10 11 12 13 14 15; U5 1 2 3 4 5 8 11 12 13 14 15 16 17 18 21

## Via types
v1: diameter 0.61, hole 0.305, Top Layer to Bottom Layer, 37 vias

## Routing (per net, layer and track width the routed paths; a pad name or vN(x,y) marks a point on that pad's centre or on a via; arc(x,y) is an arc through that point)
3V3: length 198.3
  Top Layer w0.254: C12.2 11.44,21.92 10.85,21.32 7.54,21.32 6.62,22.24 6.62,22.62 5.91,23.32 C13.2 2.6,26.56 U8.1 ; C12.2 11.88,22.62 U6.5 10.74,22.92 10.85,22.92 11.19,23.26 v1(11.19,23.76) ; C12.2 17.41,21.92 C9.2 ; R4.2 26.04,48.99 C7.2 22.4,45.35 C10.2 ; v1(3.43,66.54) 5.9,66.54 U1.2 6.26,66.71 21.15,66.71 22.88,68.44 25.11,68.44 25.27,68.28 25.27,67.51 R5.2 ; 7.67,33.81 7.5,33.98 7.5,34.19 U7.8 ; 7.67,33.81 C4.1 6.78,32.69 v1(5.98,31.89) ; 7.67,33.81 7.77,33.71 8.15,33.71 8.42,33.98 8.42,34.19 U7.6 8.42,34.56 8.42,34.77 7.96,35.23 U7.2 7.96,37.41 C5.1 ; C10.2 19.65,45.46 19.5,45.46 18.88,46.08 17.85,46.08 17.23,45.46 C3.1 13.54,47.66 6.68,47.66 4.79,49.54 v1(3.44,49.54) ; C10.2 19.76,42.83 U5.19 19.73,41.48 18.47,41.48 18.31,41.32 18.31,36.28 18.47,36.12 19.07,36.12 19.73,35.46 U5.7 19.73,32.3 C11.2 ; U3.4 U3.2 23.51,14.75 U4.4 23.51,20.08 21.28,22.3 C9.2 ; C8.1 7.69,10.22 8.17,10.69 8.17,11.18 7.5,11.85 7.5,12.47 6.62,13.35 6.05,13.35 5.29,14.11 5.29,16.72 R6.1 4.47,18.93 v1(4.21,19.19) ; C9.2 19.7,24.21 U4.16 19.76,24.41 C11.2 ; C11.2 27.7,32.27 U9.2
  Bottom Layer w0.254: v1(3.43,66.54) 3.43,49.56 v1(3.44,49.54) ; v1(5.98,31.89) 5.98,30.11 U8.1 4.21,24.78 v1(4.21,19.19) ; v1(11.19,23.76) 10.85,23.42 v1(8.16,23.42)
+5V: length 29.4
  Top Layer w0.254: D1.1 17.39,9.91 U2.B4A9 ; D1.1 18.31,13.42 v1(16.85,14.87) ; D1.1 21.89,10.83 U3.3 ; v1(7.58,10.94) 7.46,11.06 4.85,11.06 4.84,11.08 4.11,11.08 3.12,12.07 C1.1
  Bottom Layer w0.254: v1(7.58,10.94) 12.92,10.94 v1(16.85,14.87)
GND: length 53.4
  Top Layer w0.254: v1(9.07,32.69) 9.26,32.88 U7.5 ; v1(11.44,20.33) 7.42,20.33 C13.1 ; U1.38 23.27,67.72 v1(19.63,64.07) 15.93,60.38 14.31,60.38 ; v1(15.51,9.54) 15.51,9.95 R2.1 ; v1(7.31,36.89) 7.31,35.64 7.6,35.34 7.6,34.94 7.96,34.59 U7.7 ; v1(8.16,22.62) v1(9.3,22.62) 10.1,21.82 U6.4
  Bottom Layer w0.254: v1(5.99,67.72) 5.99,66.93 v1(10.94,61.99) 13.02,64.07 v1(19.63,64.07) ; v1(11.44,20.33) 11.44,20.48 v1(9.3,22.62) v1(8.16,22.62) ; v1(15.51,9.54) 16.62,8.42 v1(18.31,8.42)
DN: length 39.5
  Top Layer w0.254: v1(17.29,3.01) 17.08,2.81 16.29,2.81 14.18,4.92 14.18,6 14.24,6.06 ; D2.3 10.62,11 14.24,7.38 14.24,6.06 U2.B7 14.31,5.99 14.31,5.3 14.47,5.13 15,5.13 15.16,5.3 15.16,5.99 U2.A7 ; v1(25.79,16.49) 26.05,16.74 U4.6
  Bottom Layer w0.254: v1(25.79,16.49) 25.79,15.93 25.62,15.75 25.62,6.19 22.61,3.19 18.02,3.19 17.84,3.01 v1(17.29,3.01)
DP: length 40.1
  Top Layer w0.254: D2.1 9.12,14.38 9.12,14.63 9.28,14.79 11,14.79 11.16,14.63 11.16,11.53 14.74,7.96 U2.A6 14.76,6.08 14.76,6.16 14.81,6.21 14.81,6.83 14.97,6.99 15.5,6.99 15.66,6.83 15.66,6.13 U2.B6 15.74,5.32 v1(17.29,3.77) ; U4.5 24.78,16.74 v1(25.03,16.49)
  Bottom Layer w0.254: v1(25.03,16.49) 25.03,15.93 25.21,15.75 25.21,6.36 22.44,3.59 18.02,3.59 17.84,3.77 v1(17.29,3.77)
EN: length 76
  Top Layer w0.254: v1(7.89,18.56) 0.65,25.79 0.65,34.94 U8.5 1.03,38.11 1.03,62.13 3.43,64.52 R3.2 5.85,65.03 U1.3 ; v1(23.76,8.9) 24.93,7.73 SW1.2
  Bottom Layer w0.254: v1(23.76,8.9) 14.11,18.56 v1(7.89,18.56)
IO0: length 61
  Top Layer w0.254: 5.08,7.89 5.86,7.89 v1(7,9.03) ; U1.25 21.62,51.21 v1(21.6,51.19)
  Bottom Layer w0.254: v1(21.6,51.19) 14.37,51.19 U8.6 7,34.68 v1(7,9.03)
IO32: length 22.7
  Top Layer w0.254: U1.8 11.37,58.83 12.15,58.05 16.48,58.05 16.64,58.21 16.64,59.67 22.88,65.9 23.45,65.9 U1.37
RXD0: length 71.2
  Top Layer w0.254: U1.34 22,62.64 v1(21.75,62.89) ; v1(20.91,20.37) 20.91,18.66 U4.2 ; v1(7.8,29.4) 7.47,29.4 7.29,29.58 6.87,29.58 3.75,32.7 3.49,32.7 U8.3
  Bottom Layer w0.254: U8.3 3.56,32.77 3.56,34.64 2.89,35.31 1.96,35.31 1.06,36.21 1.06,43.37 20.76,63.07 21.01,63.07 21.19,62.89 v1(21.75,62.89) ; v1(7.8,29.4) 8.36,29.4 8.54,29.58 8.8,29.58 17.18,21.2 20.33,21.2 20.51,21.02 20.51,20.77 v1(20.91,20.37)
SCL: length 69.7
  Top Layer w0.254: U1.36 26.03,65.18 R5.1 26.07,63.67 26.25,63.49 26.67,63.49 27.09,63.07 27.09,60.62 27.95,59.75 U9.4 ; U5.9 22.23,34.18 v1(23.51,32.91) ; U6.6 10.3,23.56 10.3,34.71 10.13,34.89 10.13,34.94 9.62,35.44 9.57,35.44 9.14,35.88 9.14,36.13 9.26,36.26 U7.4 ; v1(10.56,36.84) 9.31,36.84
  Bottom Layer w0.254: v1(10.56,36.84) 14.49,32.91 v1(23.51,32.91) 23.76,32.91 U9.4
SDA: length 78.1
  Top Layer w0.254: U6.3 8.05,21.82 7.58,22.3 7.58,23.75 7.76,23.93 7.84,23.93 7.92,24.01 8.41,24.01 8.49,23.93 8.57,23.93 8.77,23.73 9.24,23.73 9.89,24.38 9.89,34.55 9.72,34.72 9.72,34.77 9.45,35.04 9.4,35.04 8.73,35.71 8.73,36.13 8.61,36.26 v1(8.61,36.89) ; U1.33 24,61.37 26.04,61.37 26.04,62.88 26.25,63.09 26.5,63.09 26.68,62.91 26.68,60.45 26.75,60.38 26.75,35.76 27.95,34.56 23.73,34.56 U5.10
  Bottom Layer w0.254: v1(8.61,36.89) 13.23,32.27 25.67,32.27 27.95,34.56
TXD0: length 69.2
  Top Layer w0.254: U1.35 22,63.91 v1(21.75,63.65) ; U8.4 3.49,33.11 3.92,33.11 7.04,29.99 7.29,29.99 7.47,30.16 v1(7.8,30.16) ; U4.3 22.24,18.77 21.57,19.44 21.57,20.79 v1(21.45,20.91)
  Bottom Layer w0.254: v1(7.8,30.16) 8.36,30.16 8.54,29.99 8.96,29.99 17.35,21.6 20.5,21.6 20.8,21.3 21.05,21.3 v1(21.45,20.91) ; U8.4 0.65,35.95 0.65,43.54 20.59,63.47 21.01,63.47 21.19,63.65 v1(21.75,63.65)
USB_VBUS: length 14.4
  Top Layer w0.254: D2.5 10.07,15.87 10.07,15.62 10.23,15.46 12.56,15.46 F1.1 13.98,14.03 13.98,12.38 13.47,11.86 13.47,10.76 13.98,10.25 v1(13.98,9.79)
  Bottom Layer w0.254: v1(13.98,9.79) 12.59,8.39 v1(12.59,6.06)
$1N863: length 5.7
  Top Layer w0.254: R1.2 9.62,4.16 12.52,4.16 13.66,5.3 13.66,5.99 U2.A5
$1N889: length 5.7
  Top Layer w0.254: R2.2 16.74,10.23 U2.B5
$1N3374: length 2.9
  Top Layer w0.254: R6.2 5.97,17.53 LED1.2

## Copper pours and planes (outline as drawn; the poured copper is in the pictures)
GND on Top Layer: -5.32,79.77 37.22,79.77 37.22,-8.62 -5.32,-8.62
GND on Bottom Layer: -3.92,78.37 33.67,78.37 33.67,-4.69 -3.92,-4.69

# Board PCB2
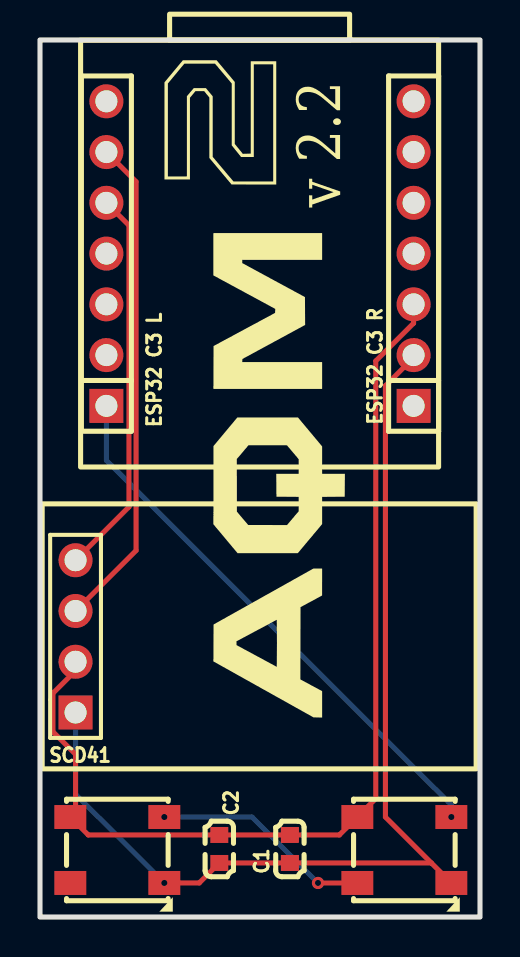
[diagram p4: board, top side]
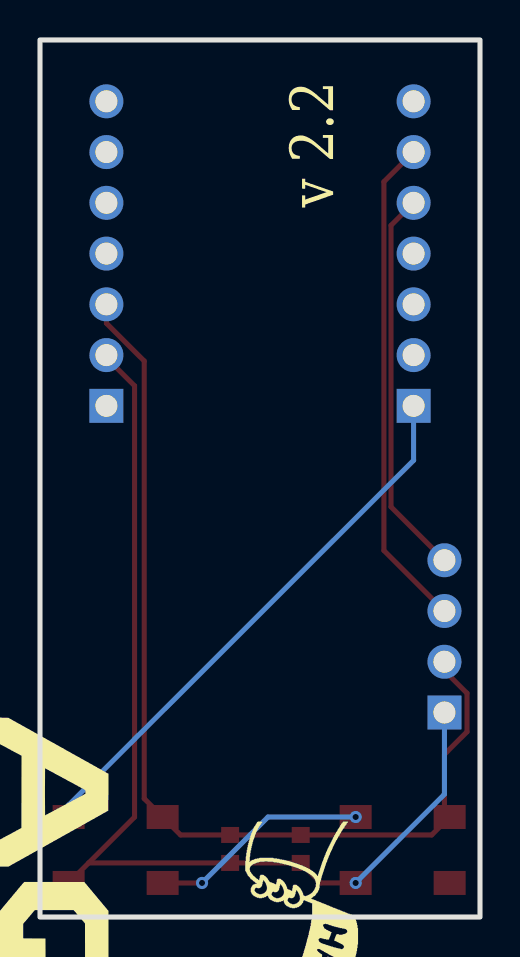
[diagram p5: board, bottom side, seen from below]

Outline 22 x 43.89 mm; copper layers: Top Layer, Bottom Layer. Coordinates in mm from the lower left corner of the outline.
Outline path: rectangle 0,43.89 22,0
Stack: Top Layer 0.035mm / Dielectric1 1.51mm FR4 er 4.5 / Bottom Layer 0.035mm

## Design rules (mm)
template: JLCPCB Capability(Two Layers Board)
spacing copperThickness1oz (default): track to track 0.102, other pairs 0.152 to 0.3
spacing copperThickness2oz: track to track 0.203, other pairs 0.152 to 0.3
track width copperThickness1oz (default): min 0.127, default 0.254, max 2.54
track width copperThickness2oz: min 0.203, default 0.254, max 2.54
differential pair differentialPair (default): width min 0.127, default 0.254, max 2.54; gap min 0.152, default 0.152
via viaSize (default): diameter min 0.5, default 0.61, max 10; hole min 0.3, default 0.305, max 6.3

## Placement (name value [footprint] x y rotation side)
C1  0.1uF  [C0603]  12.49 3.41 90 top
C2  0.1uF  [C0603]  8.96 3.41 90 top
ESP32 C3 L  ESP32C3L  [HDR-TH_7P-P2.54-V-M]  3.32 33.2 90 top
ESP32 C3 R  ESP32C3R  [HDR-TH_7P-P2.54-V-M]  18.68 33.2 90 top
SCD41  2.54-1*4  [HDR-TH_4P-P2.54-V-M-1]  1.78 14.05 90 top
U1  SK6812  [LED-SMD_4P-L5.0-W5.0-LS5.4-TL-1]  18.22 3.36 0 top
U2  SK6812  [LED-SMD_4P-L5.0-W5.0-LS5.4-TL-1]  3.87 3.36 0 top

## Footprints (pads in the part's own frame, mm; a bottom-side part is the same pattern mirrored in y, then rotated)
C0603
  rect 0.8x0.9 smd: 1(-0.7,0) 2(0.7,0)
HDR-TH_4P-P2.54-V-M-1
  rect 1.7x1.7 hole 1.1: 1(-3.81,0)
  round 1.7 hole 1.1: 2(-1.27,0) 3(1.27,0) 4(3.81,0)
HDR-TH_7P-P2.54-V-M
  rect 1.7x1.7 hole 1.1: 1(-7.62,0)
  round 1.7 hole 1.1: 2(-5.08,0) 3(-2.54,0) 4(0,0) 5(2.54,0) 6(5.08,0) 7(7.62,0)
LED-SMD_4P-L5.0-W5.0-LS5.4-TL-1
  rect 1.6x1.2 smd: 1(-2.35,1.65) 2(-2.35,-1.65) 3(2.35,-1.65) 4(2.35,1.65)

## Nets
3V3: C1.2 C2.2 ESP32 C3 R.3 SCD41.2 U1.1 U2.1
GND: C1.1 C2.1 ESP32 C3 R.2 SCD41.1 U1.3 U2.3
IO2: ESP32 C3 L.1 U1.4
LED1OUT: U1.2 U2.4
SCL: ESP32 C3 L.6 SCD41.3
SDA: ESP32 C3 L.5 SCD41.4

Pads without a net: ESP32 C3 L 2 3 4 7; ESP32 C3 R 1 4 5 6 7; U2 2

## Via types
v1: diameter 0.61, hole 0.305, Top Layer to Bottom Layer, 4 vias

## Routing (per net, layer and track width the routed paths; a pad name or vN(x,y) marks a point on that pad's centre or on a via; arc(x,y) is an arc through that point)
3V3: length 50.7
  Top Layer w0.254: ESP32 C3 R.3 18.68,29.72 16.79,27.83 16.79,5.93 U1.1 14.97,4.11 C1.2 C2.2 2.41,4.11 U2.1 1.78,5.27 1.78,8.14 0.65,9.27 0.65,11.2 1.78,12.33 SCD41.2
GND: length 52.5
  Top Layer w0.254: U1.3 19.57,2.71 ; 19.57,2.71 C1.1 C2.1 7.96,1.71 v1(6.22,1.71) ; 19.57,2.71 17.27,5 17.27,26.58 18.68,27.99 ESP32 C3 R.2
  Bottom Layer w0.254: SCD41.1 1.78,6.14 v1(6.22,1.71)
IO2: length 27.7
  Bottom Layer w0.254: v1(20.57,5.01) 20.57,5.61 3.32,22.85 ESP32 C3 L.1
LED1OUT: length 11
  Top Layer w0.254: v1(13.9,1.7) 15.87,1.7
  Bottom Layer w0.254: v1(6.22,5.01) 10.6,5.01 v1(13.9,1.7)
SCL: length 24.8
  Top Layer w0.254: ESP32 C3 L.6 4.8,36.8 4.8,18.34 SCD41.3
SDA: length 19.5
  Top Layer w0.254: SCD41.4 4.45,20.53 4.45,34.61 ESP32 C3 L.5

## Text on the board
Bottom Silkscreen Layer: v 2.2
Top Silkscreen Layer: v 2.2
